# EAGLE design base (EAGLE 6.1)
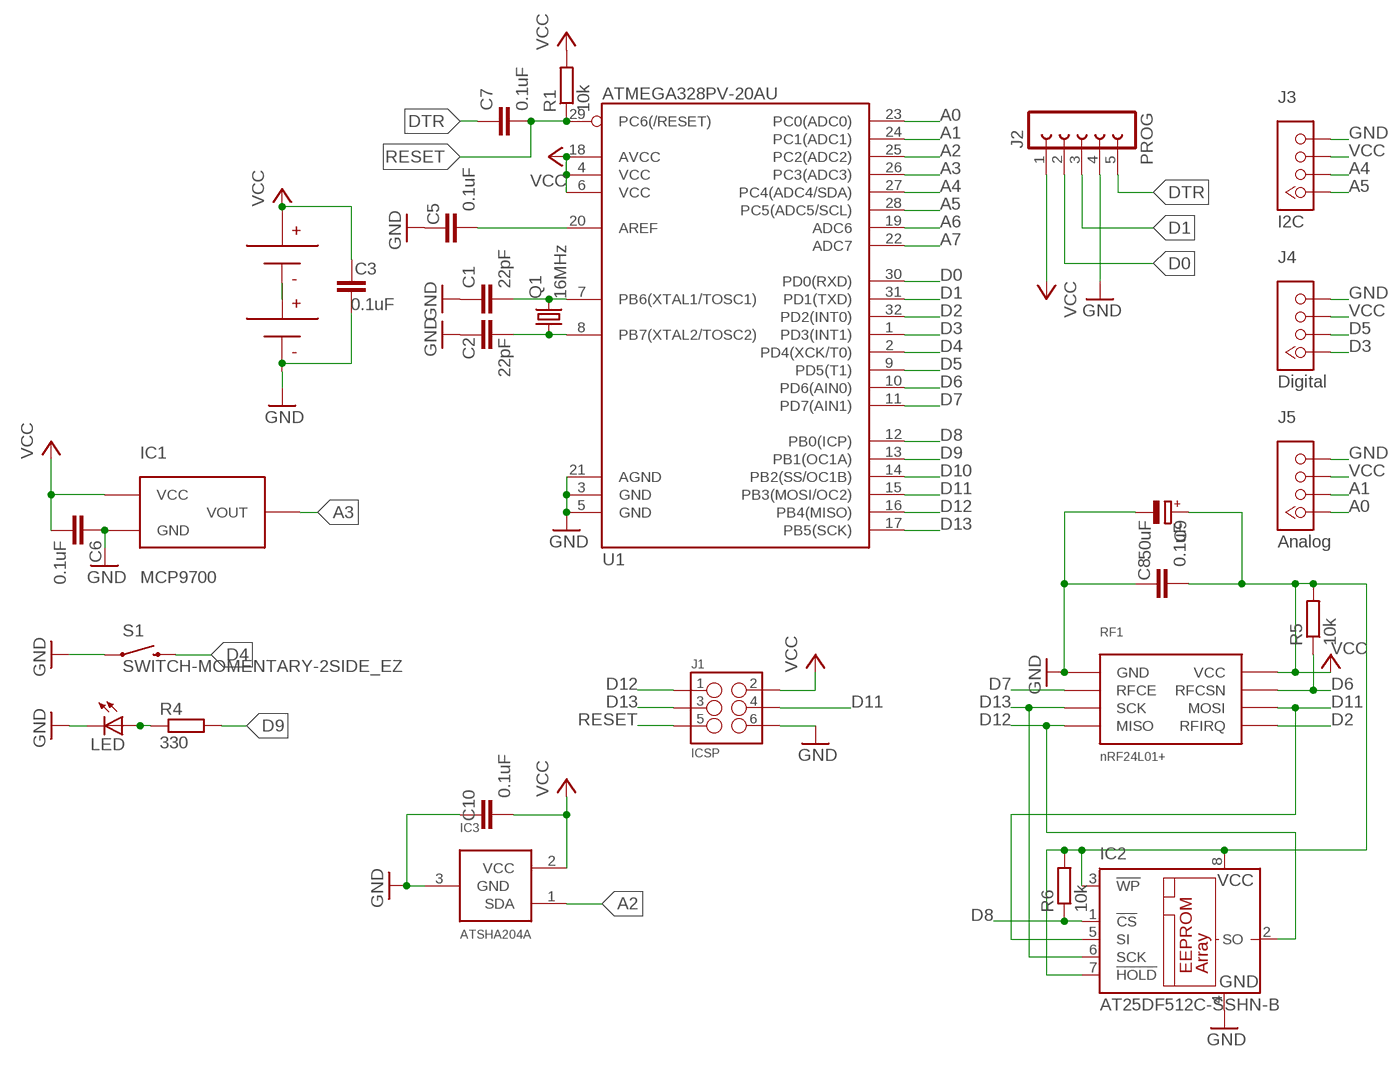
[diagram p0: schematic, sheet 1]

## Parts
BATT1  AAA-HOLDER  [AAA-HOLDER]
BATT2  AAA-HOLDER  [AAA-HOLDER]
C1  22pF  C-EUC0805  [C0805]
C2  22pF  C-EUC0805  [C0805]
C3  0.1uF  C-EUC0805  [C0805]
C5  0.1uF  C-EUC0805  [C0805]
C6  0.1uF  C-EUC0805  [C0805]
C7  0.1uF  C-EUC0805  [C0805]
C8  0.1uF  C-EUC0805  [C0805]
C9  50uF  CPOL-EUSMCC  [SMC_C]
C10  0.1uF  C-EUC0805  [C0805]
IC1  MCP9700  [SOT23]
IC2  AT25DF512C-SSHN-B  25AA080SN  [SO-08]
IC3  ATSHA204A  [SOT23]
J1  ICSP  M03X2NO_SILK  [2X3-NS]
J3  I2C  TWIG-4P-2.0  [TWIG-4P-2.0]
J4  Digital  TWIG-4P-2.0  [TWIG-4P-2.0]
J5  Analog  TWIG-4P-2.0  [TWIG-4P-2.0]
LED  LEDCHIPLED_0805  [CHIPLED_0805]
PROG  J2  FE05-1  [FE05-1]
Q1  16MHz  CRYSTALCTS406  [CTS406]
R1  10k  R-EU_R0805  [R0805]
R4  330  R-EU_R0805  [R0805]
R5  10k  R-EU_R0805  [R0805]
R6  10k  R-EU_R0805  [R0805]
RF1  nRF24L01+  NRF24L01  [2X4-2.54MM]
S1  SWITCH-MOMENTARY-2SIDE_EZ  [TACTILE-PTH-SIDEEZ]
U1  ATMEGA328PV-20AU  ATMEGA328_SMT  [TQFP32-08]

## Nets
A0: J5.P$1 U1.23(PC0(ADC0))
A1: J5.P$2 U1.24(PC1(ADC1))
A2: IC3.1(SDA) U1.25(PC2(ADC2))
A3: IC1.VOUT U1.26(PC3(ADC3))
A4: J3.P$2 U1.27(PC4(ADC4/SDA))
A5: J3.P$1 U1.28(PC5(ADC5/SCL))
A6: U1.19(ADC6)
A7: U1.22(ADC7)
D0: PROG.2 U1.30(PD0(RXD))
D1: PROG.3 U1.31(PD1(TXD))
D2: RF1.P$8(RFIRQ) U1.32(PD2(INT0))
D3: J4.P$1 U1.1(PD3(INT1))
D4: S1.2 U1.2(PD4(XCK/T0))
D5: J4.P$2 U1.9(PD5(T1))
D6: R5.1 RF1.P$4(RFCSN) U1.10(PD6(AIN0))
D7: RF1.P$3(RFCE) U1.11(PD7(AIN1))
D8: IC2.1(!CS) R6.1 U1.12(PB0(ICP))
D9: R4.2 U1.13(PB1(OC1A))
D10: U1.14(PB2(SS/OC1B))
D11: IC2.5(SI) J1.4 RF1.P$6(MOSI) U1.15(PB3(MOSI/OC2))
D12: IC2.2(SO) J1.1 RF1.P$7(MISO) U1.16(PB4(MISO))
D13: IC2.6(SCK) J1.3 RF1.P$5(SCK) U1.17(PB5(SCK))
DTR: C7.1 PROG.5
GND: BATT2.MINUS C1.1 C2.1 C3.1 C5.2 C6.1 C8.2 C9.- C10.2 IC1.GND IC2.4(GND) IC3.3(GND) J1.6 J3.P$4 J4.P$4 J5.P$4 LED.C PROG.4 RF1.P$1(GND) S1.1 U1.3(GND) U1.5(GND) U1.21(AGND)
MINUS: BATT1.MINUS BATT2.PLUS
N$1: C1.2 Q1.3 U1.7(PB6(XTAL1/TOSC1))
N$2: C2.2 Q1.1 U1.8(PB7(XTAL2/TOSC2))
N$5: C5.1 U1.20(AREF)
N$6: LED.A R4.1
RESET: C7.2 J1.5 R1.1 U1.29(PC6(/RESET))
VCC: BATT1.PLUS C3.2 C6.2 C8.1 C9.+ C10.1 IC1.VDD(VCC) IC2.3(!WP) IC2.7(!HOLD) IC2.8(VCC) IC3.2(VCC) J1.2 J3.P$3 J4.P$3 J5.P$3 PROG.1 R1.2 R5.2 R6.2 RF1.P$2(VCC) U1.4(VCC) U1.6(VCC) U1.18(AVCC)

## Library data of the parts
BATT1 BATT2 = matrix:AAA-HOLDER
C1-C3 C5-C8 C10 = rcl:C-EU: CAPACITOR, European symbol
C9 = rcl:CPOL-EU: POLARIZED CAPACITOR, European symbol
IC1 = matrix:MCP9700
IC2 = microchip:25*: Serial EEPROM 4K/ 8K , SPI bus; MF: MICROCHIP; MPN: 25AA080/SN; OC_FARNELL: 1816072; OC_NEWARK: 92C7351
IC3 = Sensor:ATSHA204A
J1 = SparkFun-Connectors:M03X2: 2x3 .1" header. Shrouded, with keying- CONN-10681 SMT- CONN-11415 Pogo pins- HW-11044
J3-J5 = matrix:TWIG-4P-2.0
LED = led:LED: LED OSRAM: - CHIPLED LG R971, LG N971, LY N971, LG Q971, LY Q971, LO R971, LY R971 LH N974, LH R974 LS Q976, LO Q976, LY Q976 LO Q996 - Hyper CHIPLED LW Q18S LB Q993, LB Q99A, LB R99A - SideLED LS A670, LO A670, LY A670, LG A670, LP A670 LB A673, LV A673, LT A673, LW A673 LH A674 LY A675 LS A676, LA A676, LO A676, LY A676, LW A676 LS A679, LY A679, LG A679 - Hyper Micro SIDELED® LS Y876, LA Y876, LO Y876, LY Y876 LT Y87S - SmartLED LW L88C, LW L88S LB L89C, LB L89S, LG L890 LS L89K, LO L89K, LY L89K LS L896, LA L896, LO L896, LY L896 - TOPLED LS T670, LO T670, LY T670, LG T670, LP T670 LSG T670, LSP T670, LSY T670, LOP T670, LYG T670 LG T671, LOG T671, LSG T671 LB T673, LV T673, LT T673, LW T673 LH T674 LS T676, LA T676, LO T676, LY T676, LB T676, LH T676, LSB T676, LW T676 LB T67C, LV T67C, LT T67C, LS T67K, LO T67K, LY T67K, LW E67C LS E67B, LA E67B, LO E67B, LY E67B, LB E67C, LV E67C, LT E67C LW T67C LS T679, LY T679, LG T679 LS T770, LO T770, LY T770, LG T770, LP T770 LB T773, LV T773, LT T773, LW T773 LH T774 LS E675, LA E675, LY E675, LS T675 LS T776, LA T776, LO T776, LY T776, LB T776 LHGB T686 LT T68C, LB T68C - Hyper Mini TOPLED® LB M676 - Mini TOPLED Santana® LG M470 LS M47K, LO M47K, LY M47K Source: http://www.osram.convergy.de LUXEON: - LUMILED® LXK2-PW12-R00, LXK2-PW12-S00, LXK2-PW14-U00, LXK2-PW14-V00 LXK2-PM12-R00, LXK2-PM12-S00, LXK2-PM14-U00 LXK2-PE12-Q00, LXK2-PE12-R00, LXK2-PE12-S00, LXK2-PE14-T00, LXK2-PE14-U00 LXK2-PB12-K00, LXK2-PB12-L00, LXK2-PB12-M00, LXK2-PB14-N00, LXK2-PB14-P00, LXK2-PB14-Q00 LXK2-PR12-L00, LXK2-PR12-M00, LXK2-PR14-Q00, LXK2-PR14-R00 LXK2-PD12-Q00, LXK2-PD12-R00, LXK2-PD12-S00 LXK2-PH12-R00, LXK2-PH12-S00 LXK2-PL12-P00, LXK2-PL12-Q00, LXK2-PL12-R00 Source: www.luxeon.com KINGBRIGHT: KA-3528ASYC Source: www.kingbright.com
PROG = con-lsta-my:FE05-1: FEMALE HEADER; OC_FARNELL: unknown; OC_NEWARK: unknown
Q1 = crystal:CRYSTAL: CRYSTAL; OC_FARNELL: unknown; OC_NEWARK: unknown
R1 R4-R6 = rcl:R-EU_: RESISTOR, European symbol
RF1 = matrix:NRF24L01
S1 = SparkFun-Electromechanical:SWITCH-MOMENTARY-2: Various NO switches- pushbuttons, reed, etc
U1 = SparkFun-DigitalIC:ATMEGA328_SMT: 32-Pin Atmega328 part Commonly used on Arduino compatible boards Available in QFP and QFN packages TQFP is IC-09069 QFN is non-stock; PROD_ID: IC-09069; VALUE: ATMEGA328P

## Board
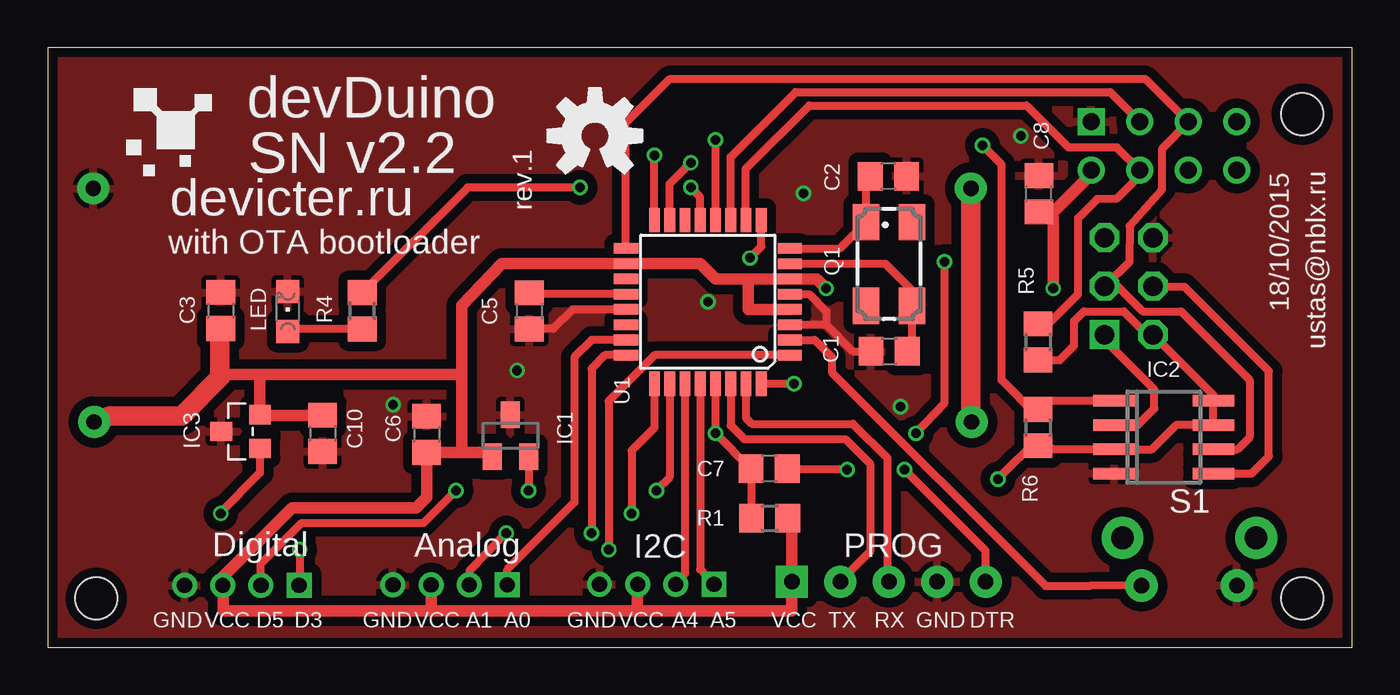
[diagram p1: board, top side]
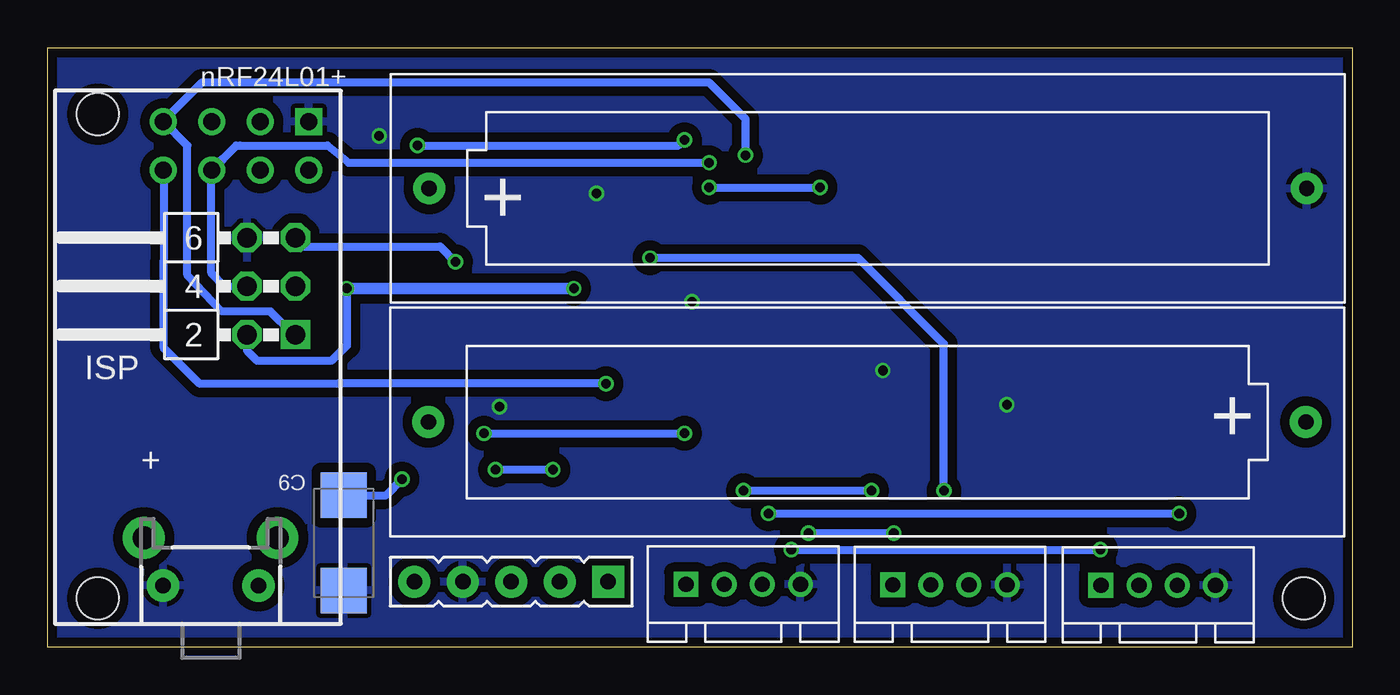
[diagram p2: board, bottom side, seen from below]

Size 68.39 x 31.45 mm. Coordinates in mm from the lower left corner, seen from the top.
Outline: 0,0 68.39,0 68.39,31.45 0,31.45 0,0
Copper layers (1*16): Top 0.035mm / dielectric 1.5mm / Bottom 0.035mm
Design rules: minimum track width 6mil, minimum drill 12mil, track to track 6mil, track to pad 6mil, pad to pad 6mil, via to via 6mil, smd to smd 0mil, copper to edge 10mil, drill to drill 10mil, minimum pad ring 10mil, minimum via ring 6mil, stop-mask expansion 2mil, vias tented up to drill 100mil, thermal gap 10mil
Holes 2.2 mm at 2.55,2.56 65.77,27.96 65.77,2.56

### Footprints (pad centres in the part's own frame; a part is rotated, then mirrored left to right if it is on the bottom)
AAA-HOLDER = drill 0.8 pad 1.676: MINUS 2,6; PLUS 48,6
C0805 = smd 1.3 x 1.5: 1 -0.95,0; 2 0.95,0
SMC_C = smd 2.4 x 2.4: + -2.5,0; - 2.5,0
SOT23 = smd 1 x 1.4: GND 0,1.1; VDD -0.95,-1.1; VOUT 0.95,-1.1
SO-08 = smd 0.6 x 2.2: 1 -1.905,-2.6; 2 -0.635,-2.6; 3 0.635,-2.6; 4 1.905,-2.6; 5 1.905,2.6; 6 0.635,2.6; 7 -0.635,2.6; 8 -1.905,2.6
SOT23' = smd 1.016 x 1.143: 1 -0.889,-1.016; 2 0.889,-1.016; 3 0,1.016
MA03-2W = drill 1.016 square: 1 0,0 | drill 1.016 octagon: 2 0,2.54; 3 2.54,0; 4 2.54,2.54; 5 5.08,0; 6 5.08,2.54
TWIG-4P-2.0 = drill 0.8 square: P$1 0,0 | drill 0.8: P$2 0,2; P$3 0,4; P$4 0,6
CHIPLED_0805 = smd 1.2 x 1.2: A 0,-1.05; C 0,1.05
FE05-1 = drill 0.813 pad 1.676 square: 1 -5.08,0 | drill 0.813 pad 1.676: 2 -2.54,0; 3 0,0; 4 2.54,0; 5 5.08,0
CTS406 = smd 1.9 x 1.4: 1 -2.2,-1.2; 2 2.2,-1.2; 3 2.2,1.2; 4 -2.2,1.2
R0805 = smd 1.3 x 1.5: 1 -0.95,0; 2 0.95,0
2X4-2.54MM = drill 0.9 square: P$1 0,0 | drill 0.9: P$2 2.54,0; P$3 0,-2.54; P$4 2.54,-2.54; P$5 0,-5.08; P$6 2.54,-5.08; P$7 0,-7.62; P$8 2.54,-7.62
TACTILE-PTH-SIDEEZ = drill 0.8 pad 1.7: 1 -2.5,0; 2 2.5,0 | drill 1.2 pad 2.2: ANCHOR1 -3.5,2.5; ANCHOR2 3.5,2.5
TQFP32-08 = smd 1.27 x 0.559: 1 -4.293,2.8; 2 -4.293,2; 3 -4.293,1.2; 4 -4.293,0.4; 5 -4.293,-0.4; 6 -4.293,-1.2; 7 -4.293,-2; 8 -4.293,-2.8; 17 4.293,-2.8; 18 4.293,-2; 19 4.293,-1.2; 20 4.293,-0.4; 21 4.293,0.4; 22 4.293,1.2; 23 4.293,2; 24 4.293,2.8 | smd 0.559 x 1.27: 9 -2.8,-4.293; 10 -2,-4.293; 11 -1.2,-4.293; 12 -0.4,-4.293; 13 0.4,-4.293; 14 1.2,-4.293; 15 2,-4.293; 16 2.8,-4.293; 25 2.8,4.293; 26 2,4.293; 27 1.2,4.293; 28 0.4,4.293; 29 -0.4,4.293; 30 -1.2,4.293; 31 -2,4.293; 32 -2.8,4.293

### Placement (x,y rotation side)
BATT1  50.43,5.81 0 bottom
BATT2  0.39,30.07 180 bottom
C1  44.1,15.52 0 top
C2  44.07,24.7 180 top
C3  9.07,17.66 270 top
C5  25.24,17.64 270 top
C6  19.86,11.16 270 top
C7  37.81,9.36 180 top
C8  51.96,23.78 90 top
C9  52.87,5.47 270 bottom
C10  14.41,11.22 270 top
E$1  [OSHW-LOGO-M]  28.68,26.83 0 top
IC1  24.26,11.09 0 top
IC2  58.51,11.02 270 top
IC3  ATSHA204A  [SOT23']  10.11,11.32 90 top
J1  ICSP  [MA03-2W]  55.4,16.4 90 bottom
J3  34.93,3.29 270 bottom
J4  13.18,3.25 270 bottom
J5  24.09,3.27 270 bottom
LED  12.59,17.62 0 top
PROG  44.09,3.43 180 bottom
Q1  44.1,20.11 270 top
R1  37.84,6.78 0 top
R4  16.49,17.65 90 top
R5  51.91,16.02 270 top
R6  51.91,11.52 270 top
RF1  54.7,27.56 270 bottom
S1  59.84,3.23 0 bottom
U1  34.6,18.12 180 top

### Tracks (layer width: path | path; a pad name or v marks a point on that pad's centre or on a via)
A0
  Top 0.406: U1.23 28.51,16.12 27.61,15.22 27.61,7.59 24.09,4.07 J5.P$1
A1  (via drill 0.5)
  Top 0.406: U1.24 29.21,15.32 28.51,14.62 v28.51,5.99 | v24.04,5.99 22.11,4.02 22.11,3.26 | 22.11,3.22 22.11,3.26 | 22.11,3.26 J5.P$2
  Bottom 0.406: v28.51,5.99 v24.04,5.99
A2  (via drill 0.5)
  Top 0.406: U1.25 31.8,11.51 30.61,10.32 v30.61,7.02 | IC3.1 11.13,9.13 9.01,7.02 v9.07,7.02
  Bottom 0.406: v30.61,7.02 v9.07,7.02
A3  (via drill 0.5)
  Top 0.406: IC1.VOUT 25.21,8.31 25.21,8.32 v25.21,8.22 | U1.26 32.6,8.91 v31.91,8.22
  Bottom 0.406: v31.91,8.22 v25.21,8.22
A4
  Top 0.406: U1.27 33.4,3.86 J3.P$2
A5
  Top 0.406: U1.28 34.2,4.08 J3.P$1
D0
  Top 0.406: U1.30 35.8,11.62 36.51,10.92 41.81,10.92 43.11,9.62 43.11,5.02 41.61,3.52 41.61,3.5 PROG.2
D1
  Top 0.406: U1.31 36.6,12.02 36.91,11.72 42.21,11.72 44.01,9.92 44.01,3.51 PROG.3
D2  (via drill 0.5)
  Top 0.406: v39.12,13.82 v39.11,13.82 37.41,13.82 U1.32
  Bottom 0.406: RF1.P$8 62.31,24.93 62.31,24.92 62.32,15.72 60.41,13.82 53.21,13.82 53.2,13.82 v39.12,13.82
D3  (via drill 0.5)
  Top 0.406: U1.1 31.81,15.32 29.41,12.92 v29.41,5.12 | v13.21,5.12 13.21,3.22 J4.P$1
  Bottom 0.406: v29.41,5.12 v13.21,5.12
D4
  Top 0.406: S1.2 57.13,3.23 54.61,3.22 52.31,3.22 41.11,14.42 41.11,15.22 40.21,16.12 U1.2
D5  (via drill 0.5)
  Top 0.406: J4.P$2 11.18,4.38 13.31,6.52 19.71,6.52 v21.41,8.22 | v36.81,20.42 37.41,21.02 U1.9
  Bottom 0.406: v21.41,8.22 21.41,15.92 25.91,20.42 v36.81,20.42
D6
  Top 0.406: U1.10 36.6,25.11 39.91,28.42 51.31,28.42 53.51,26.22 56.05,26.22 RF1.P$4 57.24,24.75 56.01,23.52 55.01,23.52 54.01,22.52 54.01,18.52 52.46,16.97 R5.1
D7
  Top 0.406: U1.11 35.8,25.71 39.21,29.12 55.69,29.12 RF1.P$3
D8  (via drill 0.5)
  Top 0.406: IC2.1 52.1,12.92 52.01,12.52 51.96,12.47 R6.1 51.91,12.12 50.01,14.02 50.01,25.32 v49.01,26.32 | v35.01,26.62 35,26.11 U1.12
  Bottom 0.406: v49.01,26.32 35.31,26.32 v35.01,26.62
D9  (via drill 0.5)
  Top 0.406: U1.13 34.2,23.62 v33.71,24.12 | v27.91,24.12 22.01,24.12 R4.2
  Bottom 0.406: v33.71,24.12 v27.91,24.12
D11  (via drill 0.5)
  Top 0.406: v33.71,25.42 32.6,24.31 U1.15 | IC2.5 63.1,9.11 64.01,10.02 64.01,14.48 59.59,18.9 57.98,18.9 J1.4
  Bottom 0.406: RF1.P$6 59.78,24.99 58.51,26.32 | v33.71,25.42 52.61,25.42 53.71,26.32 58.31,26.32 58.51,26.32 | J1.4 59.09,18.9 59.81,19.62 59.81,25.02 58.51,26.32
D12  (via drill 0.5)
  Top 0.406: U1.16 v31.8,25.81 | IC2.2 57.14,11.65 58.01,12.52 58.01,13.52 55.45,16.07 55.45,16.34 J1.1
  Bottom 0.406: RF1.P$7 61.06,26.32 61.06,19.52 59.26,17.62 56.71,17.62 55.55,16.46 55.46,16.46 J1.1 | RF1.P$7 62.36,27.62 | RF1.P$7 62.41,27.56 RF1.P$7 62.31,27.57 62.31,27.62 60.31,29.62 33.71,29.62 31.8,27.71 v31.8,25.81
D13
  Top 0.406: U1.17 | U1.17 | U1.17 30.31,27.52 32.61,29.82 57.53,29.82 RF1.P$5 59.78,27.54 58.41,26.12 58.41,24.02 56.71,22.12 56.7,20.22 J1.3 56.1,18.93 57.41,17.62 59.41,17.62 63.01,14.02 63.01,11.02 62.38,10.38 IC2.6
DTR  (via drill 0.5)
  Top 0.406: PROG.5 49.17,5.06 v44.91,9.32 | v41.91,9.32 38.81,9.32 C7.1
  Bottom 0.406: v44.91,9.32 v41.91,9.32
GND  (via drill 0.5)
  Top 0.406: U1.21 27.51,17.72 26.51,16.72 25.21,16.72 | U1.5 39.92,18.52 40.82,17.62 40.81,16.92 | U1.3 40.81,16.92 | 40.81,16.92 42.21,15.52 C1.1
  other vias: 39.61,23.82 18.11,12.72 24.61,14.52 44.71,12.62 34.61,18.12 51.01,26.82
  pour Top (isolate 0.5, rank 6): -1.69,32.22 68.61,32.22 68.61,-1.68 -1.89,-1.68 -1.89,32.22
  pour Bottom (isolate 0.5, rank 6): -3.69,33.52 70.01,33.52 70.01,-2.88 -3.69,-2.88
MINUS
  Top 0.406: 48.39,11.84 48.4,11.84 BATT1.MINUS
  Top 1.016: BATT2.PLUS 48.39,11.84 48.46,11.78
  Bottom 0.406: BATT1.MINUS 48.41,11.82
N$1
  Top 0.406: U1.7 43.91,20.12 45.21,18.82 45.21,18 Q1.3 45.3,15.77 C1.2
N$2
  Top 0.406: U1.8 41.51,20.92 Q1.1 42.9,24.48 C2.2
N$5
  Top 0.406: U1.20 25.51,18.52 25.31,18.72 25.31,18.65 C5.1
N$6
  Top 0.406: R4.1 12.72,16.7 LED.A
RESET  (via drill 0.5)  (1 unrouted)
  Top 0.406: R1.1 36.89,9.3 | 36.89,9.3 36.91,9.32 | v45.51,11.22 47.01,12.82 v47.01,20.22 | 36.89,9.3 36.89,9.33 C7.2 v35.01,11.21 | U1.29 v35,11.22 | v35.01,11.21 v35,11.22 | v35.01,11.22 v35.01,11.21 | v35,11.22
  Bottom 0.406: v45.51,11.22 v35,11.22 | J1.5 55.43,21.6 55.01,21.02 47.81,21.02 v47.01,20.22 | v35,11.22 | v35,11.22
VCC  (via drill 0.5)
  Top 0.406: 36.71,19.32 | U1.4 | 9.01,14.32 9.11,14.22 | 23.19,10.21 IC1.VDD | 30.92,1.92 30.81,1.92 | 9.21,3.32 9.21,3.22 J4.P$3 9.11,3.31 9.11,3.62 | 20.09,1.93 20.01,1.92 | PROG.1 39.01,3.51 39.01,3.52 | 39.01,6.56 R1.2 | 9.01,16.72 9.01,16.71 C3.2 | 30.61,20.12 30.51,20.12 U1.18 | 54.7,24.82 54.71,24.82 | C8.1 51.93,22.7 51.91,22.72 | 52.59,10.38 IC2.3 57.88,10.38 59.14,11.65 IC2.7 IC2.8 61.11,13.23 J1.2 57.82,16.52 57.51,16.52 56.41,17.62 54.31,17.62 53.81,17.12 53.81,15.82 53.06,15.07 R5.2 | 52.59,10.38 R6.2 | v49.81,8.82 52.01,11.02 52.59,10.43 52.59,10.38
  Top 0.61: 36.71,19.32 U1.6 40.31,19.32 v40.81,18.82 | U1.4 36.71,17.72 36.71,19.32 35.01,19.32 34.21,20.12 U1.18 | 21.61,10.21 21.71,10.32 21.71,14.32 | 21.71,14.32 11.01,14.32 | 11.01,14.32 9.01,14.32 | 21.61,10.21 C6.2 19.86,7.87 19.31,7.32 12.81,7.32 9.11,3.62 | 21.61,10.21 23.19,10.21 | PROG.1 39.01,2.41 39.01,1.92 30.81,1.92 20.01,1.92 9.21,1.92 9.21,3.22 | J3.P$3 30.92,1.92 | J5.P$3 20.09,1.93 | 39.01,3.52 39.01,6.56 | J1.2 57.96,16.37 | 30.51,20.12 23.81,20.12 21.71,17.92 21.71,14.32 | 54.71,24.82 52.56,22.67 51.96,22.67 C8.1 | v52.71,18.82 52.71,22.52 51.91,22.72 | RF1.P$2 54.7,24.82 | 11.01,14.32 11.13,14.2 IC3.2 11.16,12.17 C10.1
  Top 1.016: BATT1.PLUS 3.24,12.13 7.02,12.13 9.11,14.22 | 9.01,14.32 9.01,16.71
  Bottom 0.406: v52.71,18.82 52.71,15.82 53.51,15.02 57.41,15.02 57.91,15.52 57.94,15.59 J1.2 | C9.+ 50.65,7.97 v49.81,8.82
  Bottom 0.61: v40.81,18.82 v52.71,18.82

### Text on the board
tNames: devDuino | SN v2.2 | 18/10/2015 | ustas@nblx.ru | devicter.ru | rev.1 | with OTA bootloader | U1 | IC1 | Digital | Analog | I2C | GND | VCC | D5 | D3 | GND | VCC | A1 | A0 | GND | VCC | A4 | A5 | VCC | TX | RX | GND | DTR
bNames: ISP | +